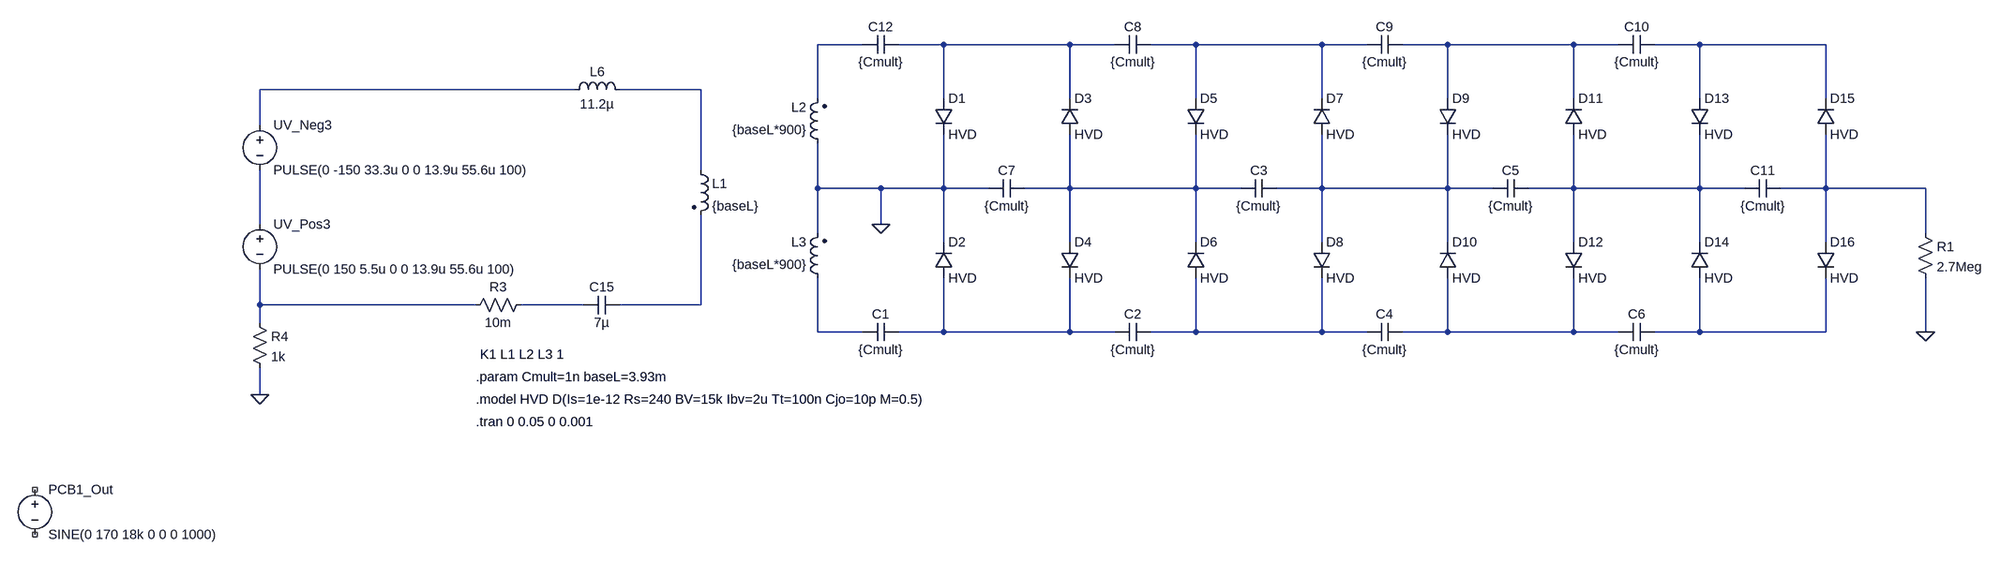
[diagram p0: schematic FullWaveVM_CoupledCoils.asc]
FullWaveVM_CoupledCoils.asc, the LTspice schematic file:
Version 4
SHEET 1 3828 736
WIRE -1136 -176 -1216 -176
WIRE -992 -176 -1072 -176
WIRE -768 -176 -992 -176
WIRE -688 -176 -768 -176
WIRE -544 -176 -624 -176
WIRE -320 -176 -544 -176
WIRE -240 -176 -320 -176
WIRE -96 -176 -176 -176
WIRE 128 -176 -96 -176
WIRE 208 -176 128 -176
WIRE 352 -176 272 -176
WIRE 576 -176 352 -176
WIRE -1648 -96 -2208 -96
WIRE -1424 -96 -1568 -96
WIRE -1216 -80 -1216 -176
WIRE -992 -80 -992 -176
WIRE -768 -80 -768 -176
WIRE -544 -80 -544 -176
WIRE -320 -80 -320 -176
WIRE -96 -80 -96 -176
WIRE 128 -80 128 -176
WIRE 352 -80 352 -176
WIRE 576 -80 576 -176
WIRE -2208 -32 -2208 -96
WIRE -1424 48 -1424 -96
WIRE -1216 80 -1216 0
WIRE -1104 80 -1216 80
WIRE -992 80 -992 -16
WIRE -992 80 -1104 80
WIRE -912 80 -992 80
WIRE -768 80 -768 -16
WIRE -768 80 -848 80
WIRE -544 80 -544 -16
WIRE -544 80 -768 80
WIRE -464 80 -544 80
WIRE -320 80 -320 -16
WIRE -320 80 -400 80
WIRE -96 80 -96 -16
WIRE -96 80 -320 80
WIRE -16 80 -96 80
WIRE 128 80 128 -16
WIRE 128 80 48 80
WIRE 352 80 352 -16
WIRE 352 80 128 80
WIRE 432 80 352 80
WIRE 576 80 576 -16
WIRE 576 80 496 80
WIRE 800 80 576 80
WIRE -2208 144 -2208 48
WIRE -1104 144 -1104 80
WIRE -1216 160 -1216 80
WIRE 800 160 800 80
WIRE -992 176 -992 80
WIRE -768 176 -768 80
WIRE -544 176 -544 80
WIRE -320 176 -320 80
WIRE -96 176 -96 80
WIRE 128 176 128 80
WIRE 352 176 352 80
WIRE 576 176 576 80
WIRE -2208 288 -2208 224
WIRE -1824 288 -2208 288
WIRE -1632 288 -1744 288
WIRE -1424 288 -1424 128
WIRE -1424 288 -1568 288
WIRE -2208 320 -2208 288
WIRE -1216 336 -1216 240
WIRE -1136 336 -1216 336
WIRE -992 336 -992 240
WIRE -992 336 -1072 336
WIRE -768 336 -768 240
WIRE -768 336 -992 336
WIRE -688 336 -768 336
WIRE -544 336 -544 240
WIRE -544 336 -624 336
WIRE -320 336 -320 240
WIRE -320 336 -544 336
WIRE -240 336 -320 336
WIRE -96 336 -96 240
WIRE -96 336 -176 336
WIRE 128 336 128 240
WIRE 128 336 -96 336
WIRE 208 336 128 336
WIRE 352 336 352 240
WIRE 352 336 272 336
WIRE 576 336 576 240
WIRE 576 336 352 336
WIRE 800 336 800 240
WIRE -2208 448 -2208 400
FLAG 800 336 0
FLAG -1104 144 0
FLAG -2208 448 0
SYMBOL cap -624 320 R90
WINDOW 0 0 32 VBottom 2
WINDOW 3 32 32 VTop 2
SYMATTR InstName C2
SYMATTR Value {Cmult}
SYMBOL cap -400 96 M270
WINDOW 0 32 32 VTop 2
WINDOW 3 0 32 VBottom 2
SYMATTR InstName C3
SYMATTR Value {Cmult}
SYMBOL cap -176 320 R90
WINDOW 0 0 32 VBottom 2
WINDOW 3 32 32 VTop 2
SYMATTR InstName C4
SYMATTR Value {Cmult}
SYMBOL res 784 144 R0
SYMATTR InstName R1
SYMATTR Value 2.7Meg
SYMBOL cap 48 96 M270
WINDOW 0 32 32 VTop 2
WINDOW 3 0 32 VBottom 2
SYMATTR InstName C5
SYMATTR Value {Cmult}
SYMBOL cap 272 320 R90
WINDOW 0 0 32 VBottom 2
WINDOW 3 32 32 VTop 2
SYMATTR InstName C6
SYMATTR Value {Cmult}
SYMBOL cap -1136 -160 R270
WINDOW 0 32 32 VTop 2
WINDOW 3 0 32 VBottom 2
SYMATTR InstName C12
SYMATTR Value {Cmult}
SYMBOL cap -848 64 R90
WINDOW 0 0 32 VBottom 2
WINDOW 3 32 32 VTop 2
SYMATTR InstName C7
SYMATTR Value {Cmult}
SYMBOL cap -624 -192 R90
WINDOW 0 0 32 VBottom 2
WINDOW 3 32 32 VTop 2
SYMATTR InstName C8
SYMATTR Value {Cmult}
SYMBOL cap -176 -192 R90
WINDOW 0 0 32 VBottom 2
WINDOW 3 32 32 VTop 2
SYMATTR InstName C9
SYMATTR Value {Cmult}
SYMBOL cap 272 -192 R90
WINDOW 0 0 32 VBottom 2
WINDOW 3 32 32 VTop 2
SYMATTR InstName C10
SYMATTR Value {Cmult}
SYMBOL cap -1136 352 R270
WINDOW 0 32 32 VTop 2
WINDOW 3 0 32 VBottom 2
SYMATTR InstName C1
SYMATTR Value {Cmult}
SYMBOL cap 496 96 M270
WINDOW 0 32 32 VTop 2
WINDOW 3 0 32 VBottom 2
SYMATTR InstName C11
SYMATTR Value {Cmult}
SYMBOL ind2 -1200 16 R180
WINDOW 0 36 80 Left 2
WINDOW 3 36 40 Left 2
SYMATTR InstName L2
SYMATTR Value {baseL*900}
SYMATTR Type ind
SYMBOL ind2 -1200 256 R180
WINDOW 0 36 80 Left 2
WINDOW 3 36 40 Left 2
SYMATTR InstName L3
SYMATTR Value {baseL*900}
SYMATTR Type ind
SYMBOL ind2 -1440 32 R0
SYMATTR InstName L1
SYMATTR Value {baseL}
SYMATTR Type ind
SYMATTR SpiceLine Rser=1
SYMBOL diode -1008 -80 R0
SYMATTR InstName D1
SYMATTR Value HVD
SYMBOL diode -1008 240 M180
WINDOW 0 24 64 Left 2
WINDOW 3 24 0 Left 2
SYMATTR InstName D2
SYMATTR Value HVD
SYMBOL diode -784 -16 M180
WINDOW 0 24 64 Left 2
WINDOW 3 24 0 Left 2
SYMATTR InstName D3
SYMATTR Value HVD
SYMBOL diode -784 176 R0
SYMATTR InstName D4
SYMATTR Value HVD
SYMBOL diode -560 -80 R0
SYMATTR InstName D5
SYMATTR Value HVD
SYMBOL diode -560 240 M180
WINDOW 0 24 64 Left 2
WINDOW 3 24 0 Left 2
SYMATTR InstName D6
SYMATTR Value HVD
SYMBOL diode -336 -16 M180
WINDOW 0 24 64 Left 2
WINDOW 3 24 0 Left 2
SYMATTR InstName D7
SYMATTR Value HVD
SYMBOL diode -336 176 R0
SYMATTR InstName D8
SYMATTR Value HVD
SYMBOL diode -112 -80 R0
SYMATTR InstName D9
SYMATTR Value HVD
SYMBOL diode -112 240 M180
WINDOW 0 24 64 Left 2
WINDOW 3 24 0 Left 2
SYMATTR InstName D10
SYMATTR Value HVD
SYMBOL diode 112 -16 M180
WINDOW 0 24 64 Left 2
WINDOW 3 24 0 Left 2
SYMATTR InstName D11
SYMATTR Value HVD
SYMBOL diode 112 176 R0
SYMATTR InstName D12
SYMATTR Value HVD
SYMBOL diode 336 -80 R0
SYMATTR InstName D13
SYMATTR Value HVD
SYMBOL diode 336 240 M180
WINDOW 0 24 64 Left 2
WINDOW 3 24 0 Left 2
SYMATTR InstName D14
SYMATTR Value HVD
SYMBOL diode 560 -16 M180
WINDOW 0 24 64 Left 2
WINDOW 3 24 0 Left 2
SYMATTR InstName D15
SYMATTR Value HVD
SYMBOL diode 560 176 R0
SYMATTR InstName D16
SYMATTR Value HVD
SYMBOL voltage -2608 624 R0
WINDOW 123 0 0 Left 0
WINDOW 39 0 0 Left 0
SYMATTR InstName PCB1_Out
SYMATTR Value SINE(0 170 18k 0 0 0 1000)
SYMBOL voltage -2208 128 R0
WINDOW 123 0 0 Left 0
WINDOW 39 0 0 Left 0
SYMATTR InstName UV_Pos3
SYMATTR Value PULSE(0 150 5.5u 0 0 13.9u 55.6u 100)
SYMBOL voltage -2208 -48 R0
WINDOW 123 0 0 Left 0
WINDOW 39 0 0 Left 0
SYMATTR InstName UV_Neg3
SYMATTR Value PULSE(0 -150 33.3u 0 0 13.9u 55.6u 100)
SYMBOL ind -1664 -80 R270
WINDOW 0 32 56 VTop 2
WINDOW 3 5 56 VBottom 2
SYMATTR InstName L6
SYMATTR Value 11.2µ
SYMBOL cap -1568 272 R90
WINDOW 0 0 32 VBottom 2
WINDOW 3 32 32 VTop 2
SYMATTR InstName C15
SYMATTR Value 7µ
SYMBOL res -1728 272 R90
WINDOW 0 0 56 VBottom 2
WINDOW 3 32 56 VTop 2
SYMATTR InstName R3
SYMATTR Value 10m
SYMBOL res -2224 304 R0
SYMATTR InstName R4
SYMATTR Value 1k
TEXT -1824 496 Left 2 !.tran 0 0.05 0 0.001
TEXT -1816 376 Left 2 !K1 L1 L2 L3 1
TEXT -1824 416 Left 2 !.param Cmult=1n baseL=3.93m
TEXT -1824 456 Left 2 !.model HVD D(Is=1e-12 Rs=240 BV=15k Ibv=2u Tt=100n Cjo=10p M=0.5)

The netlist it stands for:
* FullWaveVM_CoupledCoils.asc
C2 N018 N017 {Cmult}
C3 N009 N008 {Cmult}
C4 N019 N018 {Cmult}
R1 N011 0 2.7Meg
C5 N010 N009 {Cmult}
C6 N020 N019 {Cmult}
C12 N001 N002 {Cmult}
C7 N008 0 {Cmult}
C8 N003 N002 {Cmult}
C9 N004 N003 {Cmult}
C10 N005 N004 {Cmult}
C1 N016 N017 {Cmult}
C11 N011 N010 {Cmult}
L2 0 N001 {baseL*900}
L3 N016 0 {baseL*900}
L1 N007 N015 {baseL} Rser=1
D1 N002 0 HVD
D2 N017 0 HVD
D3 N008 N002 HVD
D4 N008 N017 HVD
D5 N003 N008 HVD
D6 N018 N008 HVD
D7 N009 N003 HVD
D8 N009 N018 HVD
D9 N004 N009 HVD
D10 N019 N009 HVD
D11 N010 N004 HVD
D12 N010 N019 HVD
D13 N005 N010 HVD
D14 N020 N010 HVD
D15 N011 N005 HVD
D16 N011 N020 HVD
V§PCB1_Out NC_01 NC_02 SINE(0 170 18k 0 0 0 1000)
V§UV_Pos3 N012 N013 PULSE(0 150 5.5u 0 0 13.9u 55.6u 100)
V§UV_Neg3 N006 N012 PULSE(0 -150 33.3u 0 0 13.9u 55.6u 100)
L6 N006 N007 11.2µ
C15 N015 N014 7µ
R3 N014 N013 10m
R4 N013 0 1k
.model D D
.lib standard.dio
.tran 0 0.05 0 0.001
K1 L1 L2 L3 1
.param Cmult=1n baseL=3.93m
.model HVD D(Is=1e-12 Rs=240 BV=15k Ibv=2u Tt=100n Cjo=10p M=0.5)
.backanno
.end